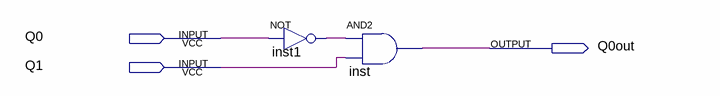
[diagram p0: schematic sheet]
// Quartus schematic P_q0.bdf as structural Verilog: 2 symbols, 3 pins
module P_q0 (
  input  Q0,
  input  Q1,
  output Q0out
);

  wire inst1_out;

  not inst1 (inst1_out, Q0);
  and inst (Q0out, inst1_out, Q1);
endmodule
